# EAGLE design untitled (EAGLE 7.7.0)
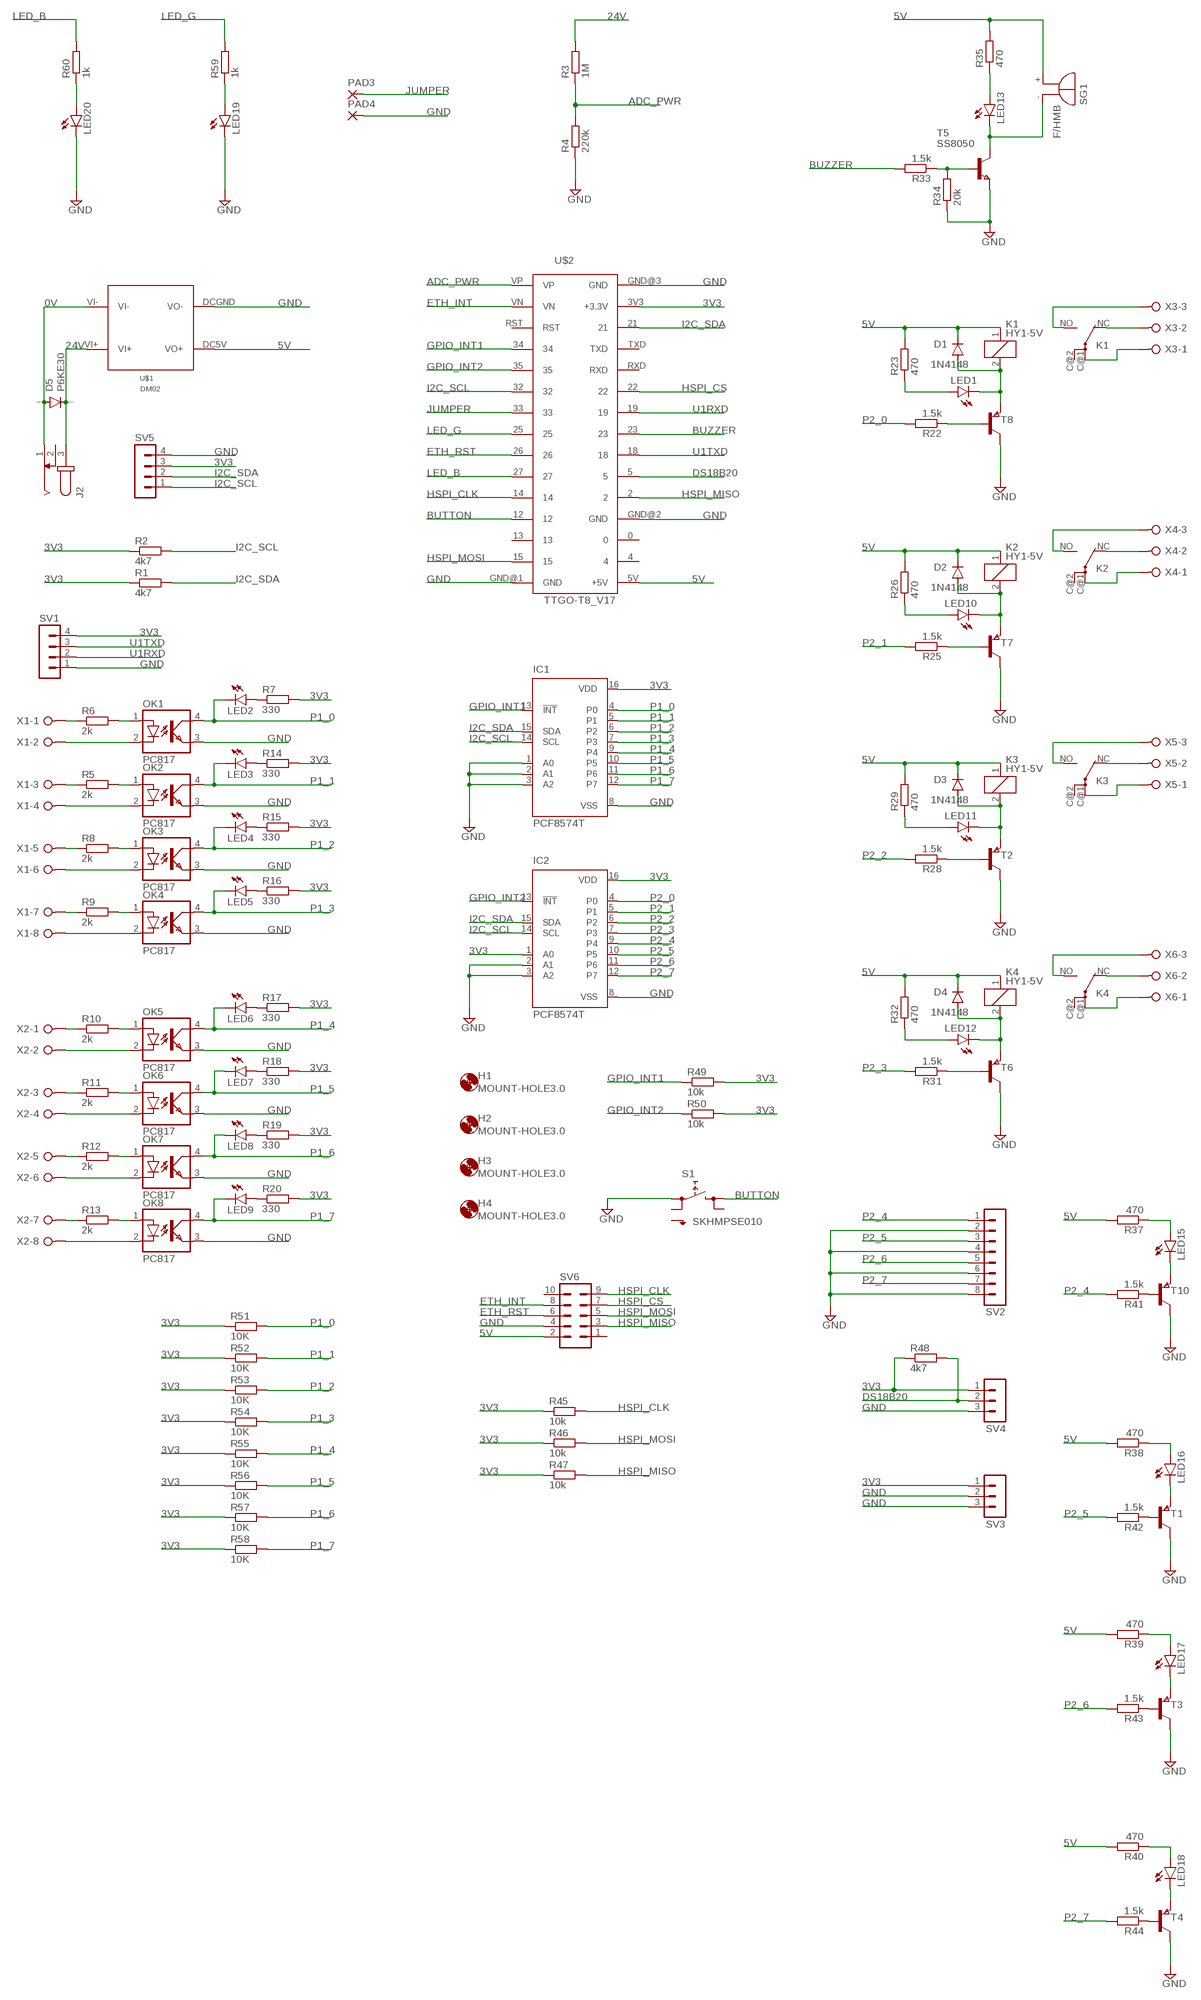
[diagram p0: schematic, sheet 1]

## Parts
D1  1N4148  DIODE-SOD123  [SOD123]
D2  1N4148  DIODE-SOD123  [SOD123]
D3  1N4148  DIODE-SOD123  [SOD123]
D4  1N4148  DIODE-SOD123  [SOD123]
D5  P6KE30  DIODE-D-10  [D-10]
H1  MOUNT-HOLE3.0  [3,0]
H2  MOUNT-HOLE3.0  [3,0]
H3  MOUNT-HOLE3.0  [3,0]
H4  MOUNT-HOLE3.0  [3,0]
IC1  PCF8574T  [SO16W]
IC2  PCF8574T  [SO16W]
J2  JACK-PLUG0  [SPC4077]
K1  HY1-5V  [HY]
K2  HY1-5V  [HY]
K3  HY1-5V  [HY]
K4  HY1-5V  [HY]
LED1  LEDCHIPLED_0805  [CHIPLED_0805]
LED2  LEDCHIPLED_0805  [CHIPLED_0805]
LED3  LEDCHIPLED_0805  [CHIPLED_0805]
LED4  LEDCHIPLED_0805  [CHIPLED_0805]
LED5  LEDCHIPLED_0805  [CHIPLED_0805]
LED6  LEDCHIPLED_0805  [CHIPLED_0805]
LED7  LEDCHIPLED_0805  [CHIPLED_0805]
LED8  LEDCHIPLED_0805  [CHIPLED_0805]
LED9  LEDCHIPLED_0805  [CHIPLED_0805]
LED10  LEDCHIPLED_0805  [CHIPLED_0805]
LED11  LEDCHIPLED_0805  [CHIPLED_0805]
LED12  LEDCHIPLED_0805  [CHIPLED_0805]
LED13  LEDCHIPLED_0805  [CHIPLED_0805]
LED15  LEDCHIPLED_0805  [CHIPLED_0805]
LED16  LEDCHIPLED_0805  [CHIPLED_0805]
LED17  LEDCHIPLED_0805  [CHIPLED_0805]
LED18  LEDCHIPLED_0805  [CHIPLED_0805]
LED19  LEDCHIPLED_0805  [CHIPLED_0805]
LED20  LEDCHIPLED_0805  [CHIPLED_0805]
OK1  PC817  [DIL04]
OK2  PC817  [DIL04]
OK3  PC817  [DIL04]
OK4  PC817  [DIL04]
OK5  PC817  [DIL04]
OK6  PC817  [DIL04]
OK7  PC817  [DIL04]
OK8  PC817  [DIL04]
PAD3  2,15/1,0  [2,15/1,0]
PAD4  2,15/1,0  [2,15/1,0]
R1  4k7  R-EU_R0603  [R0603]
R2  4k7  R-EU_R0603  [R0603]
R3  1M  R-EU_R0603  [R0603]
R4  220k  R-EU_R0603  [R0603]
R5  2k  R-EU_R0603  [R0603]
R6  2k  R-EU_R0603  [R0603]
R7  330  R-EU_R0603  [R0603]
R8  2k  R-EU_R0603  [R0603]
R9  2k  R-EU_R0603  [R0603]
R10  2k  R-EU_R0603  [R0603]
R11  2k  R-EU_R0603  [R0603]
R12  2k  R-EU_R0603  [R0603]
R13  2k  R-EU_R0603  [R0603]
R14  330  R-EU_R0603  [R0603]
R15  330  R-EU_R0603  [R0603]
R16  330  R-EU_R0603  [R0603]
R17  330  R-EU_R0603  [R0603]
R18  330  R-EU_R0603  [R0603]
R19  330  R-EU_R0603  [R0603]
R20  330  R-EU_R0603  [R0603]
R22  1.5k  R-EU_R0603  [R0603]
R23  470  R-EU_R0603  [R0603]
R25  1.5k  R-EU_R0603  [R0603]
R26  470  R-EU_R0603  [R0603]
R28  1.5k  R-EU_R0603  [R0603]
R29  470  R-EU_R0603  [R0603]
R31  1.5k  R-EU_R0603  [R0603]
R32  470  R-EU_R0603  [R0603]
R33  1.5k  R-EU_R0603  [R0603]
R34  20k  R-EU_R0603  [R0603]
R35  470  R-EU_R0603  [R0603]
R37  470  R-EU_R0603  [R0603]
R38  470  R-EU_R0603  [R0603]
R39  470  R-EU_R0603  [R0603]
R40  470  R-EU_R0603  [R0603]
R41  1.5k  R-EU_R0603  [R0603]
R42  1.5k  R-EU_R0603  [R0603]
R43  1.5k  R-EU_R0603  [R0603]
R44  1.5k  R-EU_R0603  [R0603]
R45  10k  R-EU_R0603  [R0603]
R46  10k  R-EU_R0603  [R0603]
R47  10k  R-EU_R0603  [R0603]
R48  4k7  R-EU_R0603  [R0603]
R49  10k  R-EU_R0603  [R0603]
R50  10k  R-EU_R0603  [R0603]
R51  10K  R-EU_R0603  [R0603]
R52  10K  R-EU_R0603  [R0603]
R53  10K  R-EU_R0603  [R0603]
R54  10K  R-EU_R0603  [R0603]
R55  10K  R-EU_R0603  [R0603]
R56  10K  R-EU_R0603  [R0603]
R57  10K  R-EU_R0603  [R0603]
R58  10K  R-EU_R0603  [R0603]
R59  1k  R-EU_R0603  [R0603]
R60  1k  R-EU_R0603  [R0603]
S1  SKHMPSE010  [SKHMPXE010]
SG1  F/HMB  [F/HMB]
SV1  MA04-1  [MA04-1]
SV2  MA08-1  [MA08-1]
SV3  MA03-1  [MA03-1]
SV4  MA03-1  [MA03-1]
SV5  MA04-1  [MA04-1]
SV6  MA05-2  [MA05-2]
T1  PNPSOT23  [SOT-23]
T2  PNPSOT23  [SOT-23]
T3  PNPSOT23  [SOT-23]
T4  PNPSOT23  [SOT-23]
T5  SS8050  NPNSOT23  [SOT-23]
T6  PNPSOT23  [SOT-23]
T7  PNPSOT23  [SOT-23]
T8  PNPSOT23  [SOT-23]
T10  PNPSOT23  [SOT-23]
U$1  DM02  [DM02]
U$2  TTGO-T8_V17  [TTGO-T8_V17]
X1  W237-08P  [W237-8P]
X2  W237-08P  [W237-8P]
X3  W237-03P  [W237-133]
X4  W237-03P  [W237-133]
X5  W237-03P  [W237-133]
X6  W237-03P  [W237-133]

## Nets
0V: D5.A J2.1 U$1.VI-
3V3: IC1.16(VDD) IC2.1(A0) IC2.16(VDD) R1.1 R2.1 R7.2 R14.2 R15.2 R16.2 R17.2 R18.2 R19.2 R20.2 R45.1 R46.1 R47.1 R48.1 R49.2 R50.2 R51.1 R52.1 R53.1 R54.1 R55.1 R56.1 R57.1 R58.1 SV1.4 SV3.1 SV4.1 SV5.3 U$2.3V3(+3.3V)
5V: D1.C D2.C D3.C D4.C K1.1 K2.1 K3.1 K4.1 R23.2 R26.2 R29.2 R32.2 R35.2 R37.2 R38.2 R39.2 R40.2 SG1.+ SV6.2 U$1.DC5V(VO+) U$2.5V(+5V)
24V: D5.C J2.3 R3.2 U$1.VI+
ADC_PWR: R3.1 R4.2 U$2.VP
BUTTON: S1.3(2.1) U$2.12
BUZZER: R33.2 U$2.23
DS18B20: R48.2 SV4.2 U$2.5
ETH_INT: SV6.8 U$2.VN
ETH_RST: SV6.6 U$2.26
GND: IC1.1(A0) IC1.2(A1) IC1.3(A2) IC1.8(VSS) IC2.2(A1) IC2.3(A2) IC2.8(VSS) LED19.C LED20.C OK1.3(EMIT) OK2.3(EMIT) OK3.3(EMIT) OK4.3(EMIT) OK5.3(EMIT) OK6.3(EMIT) OK7.3(EMIT) OK8.3(EMIT) PAD4.1(P) R4.1 R34.1 S1.1(1.1) SV1.1 SV2.2 SV2.4 SV2.6 SV2.8 SV3.2 SV3.3 SV4.3 SV5.4 SV6.4 T1.1(C) T2.1(C) T3.1(C) T4.1(C) T5.2(E) T6.1(C) T7.1(C) T8.1(C) T10.1(C) U$1.DCGND(VO-) U$2.GND@1(GND) U$2.GND@2(GND) U$2.GND@3(GND)
GPIO_INT1: IC1.13(!INT) R49.1 U$2.34
GPIO_INT2: IC2.13(!INT) R50.1 U$2.35
HSPI_CLK: R45.2 SV6.9 U$2.14
HSPI_CS: SV6.7 U$2.22
HSPI_MISO: R47.2 SV6.3 U$2.2
HSPI_MOSI: R46.2 SV6.5 U$2.15
I2C_SCL: IC1.14(SCL) IC2.14(SCL) R2.2 SV5.1 U$2.32
I2C_SDA: IC1.15(SDA) IC2.15(SDA) R1.2 SV5.2 U$2.21
JUMPER: PAD3.1(P) U$2.33
LED_B: R60.2 U$2.27
LED_G: R59.2 U$2.25
N$1: R5.1 X1.3
N$2: R6.1 X1.1
N$3: OK1.1(A) R6.2
N$4: OK1.2(C) X1.2
N$5: OK2.1(A) R5.2
N$6: OK2.2(C) X1.4
N$7: R8.1 X1.5
N$8: OK3.1(A) R8.2
N$9: OK3.2(C) X1.6
N$10: R9.1 X1.7
N$11: OK4.1(A) R9.2
N$12: OK4.2(C) X1.8
N$13: R10.1 X2.1
N$14: OK5.1(A) R10.2
N$15: OK5.2(C) X2.2
N$16: R11.1 X2.3
N$17: OK6.1(A) R11.2
N$18: OK6.2(C) X2.4
N$19: R12.1 X2.5
N$20: OK7.1(A) R12.2
N$21: OK7.2(C) X2.6
N$22: R13.1 X2.7
N$23: OK8.1(A) R13.2
N$24: OK8.2(C) X2.8
N$25: R25.1 T7.3(B)
N$26: LED1.A R23.1
N$27: D2.A K2.2 LED10.C T7.2(E)
N$28: LED2.A R7.1
N$29: LED3.A R14.1
N$30: LED4.A R15.1
N$32: LED15.A R37.1
N$33: LED16.C T1.2(E)
N$34: LED5.A R16.1
N$35: LED19.A R59.1
N$36: R22.1 T8.3(B)
N$37: D1.A K1.2 LED1.C T8.2(E)
N$38: K1.NO(2:S) X3.3
N$39: K1.NC(2:O) X3.2
N$40: R28.1 T2.3(B)
N$41: D3.A K3.2 LED11.C T2.2(E)
N$42: LED10.A R26.1
N$43: LED11.A R29.1
N$44: R31.1 T6.3(B)
N$45: D4.A K4.2 LED12.C T6.2(E)
N$46: LED12.A R32.1
N$47: K1.C@1(2:P) X3.1
N$48: K2.NO(2:S) X4.3
N$49: K2.NC(2:O) X4.2
N$50: K2.C@1(2:P) X4.1
N$51: K3.NO(2:S) X5.3
N$52: K3.NC(2:O) X5.2
N$53: K3.C@1(2:P) X5.1
N$54: K4.NO(2:S) X6.3
N$55: K4.NC(2:O) X6.2
N$56: K4.C@1(2:P) X6.1
N$57: LED15.C T10.2(E)
N$58: LED20.A R60.1
N$59: R33.1 R34.2 T5.3(B)
N$60: R41.1 T10.3(B)
N$61: LED13.A R35.1
N$62: LED13.C SG1.- T5.1(C)
N$63: LED9.A R20.1
N$64: LED16.A R38.1
N$65: LED17.C T3.2(E)
N$66: LED17.A R39.1
N$67: LED18.C T4.2(E)
N$68: LED18.A R40.1
N$69: R42.1 T1.3(B)
N$70: R43.1 T3.3(B)
N$71: R44.1 T4.3(B)
N$74: LED8.A R19.1
N$75: LED7.A R18.1
N$76: LED6.A R17.1
P1_0: IC1.4(P0) LED2.C OK1.4(COL) R51.2
P1_1: IC1.5(P1) LED3.C OK2.4(COL) R52.2
P1_2: IC1.6(P2) LED4.C OK3.4(COL) R53.2
P1_3: IC1.7(P3) LED5.C OK4.4(COL) R54.2
P1_4: IC1.9(P4) LED6.C OK5.4(COL) R55.2
P1_5: IC1.10(P5) LED7.C OK6.4(COL) R56.2
P1_6: IC1.11(P6) LED8.C OK7.4(COL) R57.2
P1_7: IC1.12(P7) LED9.C OK8.4(COL) R58.2
P2_0: IC2.4(P0) R22.2
P2_1: IC2.5(P1) R25.2
P2_2: IC2.6(P2) R28.2
P2_3: IC2.7(P3) R31.2
P2_4: IC2.9(P4) R41.2 SV2.1
P2_5: IC2.10(P5) R42.2 SV2.3
P2_6: IC2.11(P6) R43.2 SV2.5
P2_7: IC2.12(P7) R44.2 SV2.7
U1RXD: SV1.2 U$2.19
U1TXD: SV1.3 U$2.18
Unconnected: J2.2 K1.C@2(2:P) K2.C@2(2:P) K3.C@2(2:P) K4.C@2(2:P) S1.2(1.2) S1.4(2.2) S1.5(SH) SV6.1 SV6.10 U$2.0 U$2.4 U$2.13 U$2.RST U$2.RXD U$2.TXD

## Library data of the parts
D1-D4 = diode:DIODE-: DIODE
D5 = diode@1:DIODE-: DIODE
H1-H4 = holes:MOUNT-HOLE: MOUNTING HOLE with drill center marker
IC1 IC2 = micro-philips:PCF8574: I2C-Bus Remote 8-bit I/O expander http://www.semiconductors.philips.com/acrobat_download/datasheets/PCF8574_4.pdf; MPN: PCF8574T/3,512; OC_FARNELL: 1201255; OC_NEWARK: 70R6870
J2 = con-jack:JACK-PLUG: DC POWER JACK Power Jack, DC, Right Angle, Through Hole, Rated 5A at 16VDC, PC Terminals Distributor: Farnell (www.Farnell.de) Drawing: 84N1161.pdf / 84N1162.pdf Manufacturer: SPC Technology (www.spctechnology.com) Type: SPC4077 / SPC 4078; OC_FARNELL: unknown; OC_NEWARK: unknown
K1-K4 = relay:HY1*: Non-polarized 1 Form C Relay NAiS Source: http://www.mew-europe.com/.. en_ds_61012_0000.pdf; MF: AROMAT/ MATSUSHITA; MPN: HY1-5V; OC_FARNELL: unknown; OC_NEWARK: 10C6692
LED1-LED13 LED15-LED20 = led:LED: LED OSRAM: - CHIPLED LG R971, LG N971, LY N971, LG Q971, LY Q971, LO R971, LY R971 LH N974, LH R974 LS Q976, LO Q976, LY Q976 LO Q996 - Hyper CHIPLED LW Q18S LB Q993, LB Q99A, LB R99A - SideLED LS A670, LO A670, LY A670, LG A670, LP A670 LB A673, LV A673, LT A673, LW A673 LH A674 LY A675 LS A676, LA A676, LO A676, LY A676, LW A676 LS A679, LY A679, LG A679 - Hyper Micro SIDELED® LS Y876, LA Y876, LO Y876, LY Y876 LT Y87S - SmartLED LW L88C, LW L88S LB L89C, LB L89S, LG L890 LS L89K, LO L89K, LY L89K LS L896, LA L896, LO L896, LY L896 - TOPLED LS T670, LO T670, LY T670, LG T670, LP T670 LSG T670, LSP T670, LSY T670, LOP T670, LYG T670 LG T671, LOG T671, LSG T671 LB T673, LV T673, LT T673, LW T673 LH T674 LS T676, LA T676, LO T676, LY T676, LB T676, LH T676, LSB T676, LW T676 LB T67C, LV T67C, LT T67C, LS T67K, LO T67K, LY T67K, LW E67C LS E67B, LA E67B, LO E67B, LY E67B, LB E67C, LV E67C, LT E67C LW T67C LS T679, LY T679, LG T679 LS T770, LO T770, LY T770, LG T770, LP T770 LB T773, LV T773, LT T773, LW T773 LH T774 LS E675, LA E675, LY E675, LS T675 LS T776, LA T776, LO T776, LY T776, LB T776 LHGB T686 LT T68C, LB T68C - Hyper Mini TOPLED® LB M676 - Mini TOPLED Santana® LG M470 LS M47K, LO M47K, LY M47K Source: http://www.osram.convergy.de LUXEON: - LUMILED® LXK2-PW12-R00, LXK2-PW12-S00, LXK2-PW14-U00, LXK2-PW14-V00 LXK2-PM12-R00, LXK2-PM12-S00, LXK2-PM14-U00 LXK2-PE12-Q00, LXK2-PE12-R00, LXK2-PE12-S00, LXK2-PE14-T00, LXK2-PE14-U00 LXK2-PB12-K00, LXK2-PB12-L00, LXK2-PB12-M00, LXK2-PB14-N00, LXK2-PB14-P00, LXK2-PB14-Q00 LXK2-PR12-L00, LXK2-PR12-M00, LXK2-PR14-Q00, LXK2-PR14-R00 LXK2-PD12-Q00, LXK2-PD12-R00, LXK2-PD12-S00 LXK2-PH12-R00, LXK2-PH12-S00 LXK2-PL12-P00, LXK2-PL12-Q00, LXK2-PL12-R00 Source: www.luxeon.com KINGBRIGHT: KA-3528ASYC Source: www.kingbright.com
OK1-OK8 = optocoupler:PC817: SHARP OPTO COUPLER; MPN: PC817X4J000F; OC_FARNELL: 9707727; OC_NEWARK: 97K7059
PAD3 PAD4 = wirepad:2,15/1,0: THROUGH-HOLE PAD
R1-R20 R22 R23 R25 R26 R28 R29 R31-R35 R37-R60 = rcl:R-EU_: RESISTOR, European symbol; SPICEPREFIX: R
S1 = switch:SKHMP*E010: 6.2 X 6.5mm TACT Switch (SMD) Source: http://www3.alps.co.jp/WebObjects/catalog.woa/PDF/E/Switch/Tact/SKHM/SKHM.PDF
SG1 = buzzer:F/HMB: BUZZER Source: Buerklin; OC_FARNELL: unknown; OC_NEWARK: unknown
SV1 SV5 = con-lstb:MA04-1: PIN HEADER; OC_FARNELL: unknown; OC_NEWARK: unknown
SV2 = con-lstb:MA08-1: PIN HEADER; OC_FARNELL: unknown; OC_NEWARK: unknown
SV3 SV4 = con-lstb:MA03-1: PIN HEADER; OC_FARNELL: unknown; OC_NEWARK: unknown
SV6 = con-lstb:MA05-2: PIN HEADER; OC_FARNELL: unknown; OC_NEWARK: unknown
T1-T4 T6-T8 T10 = zetex:PNPSOT23: PNP TRANSISTOR; MPN: DSS20200L-7; OC_FARNELL: unknown; OC_NEWARK: 25R4554
T5 = zetex:NPNSOT23: NPN TRANSISTOR; MPN: DSS20201L-7; OC_FARNELL: 1710688; OC_NEWARK: 25R4555
U$1 = dm02:DM02
U$2 = TTGO-T8:TTGO-T8_V17
X1 X2 = con-wago-508:W237-08P: WAGO SREW CLAMP; OC_FARNELL: unknown; OC_NEWARK: unknown
X3-X6 = con-wago-508:W237-03P: WAGO SREW CLAMP; OC_FARNELL: unknown; OC_NEWARK: unknown

## Board
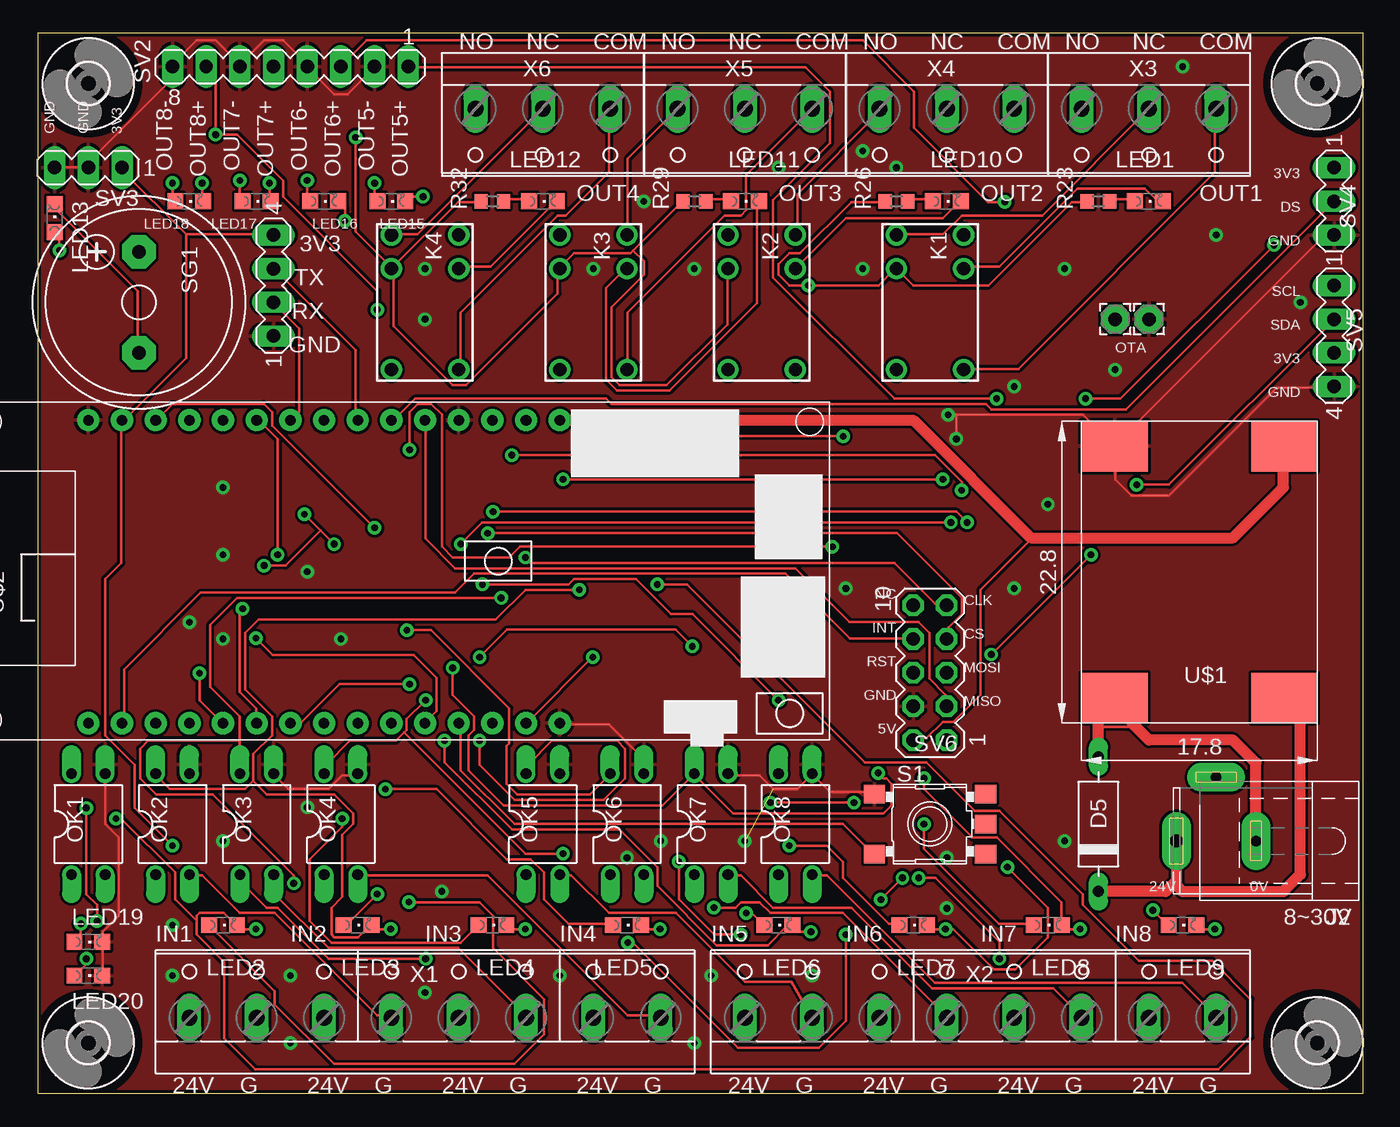
[diagram p1: board, top side]
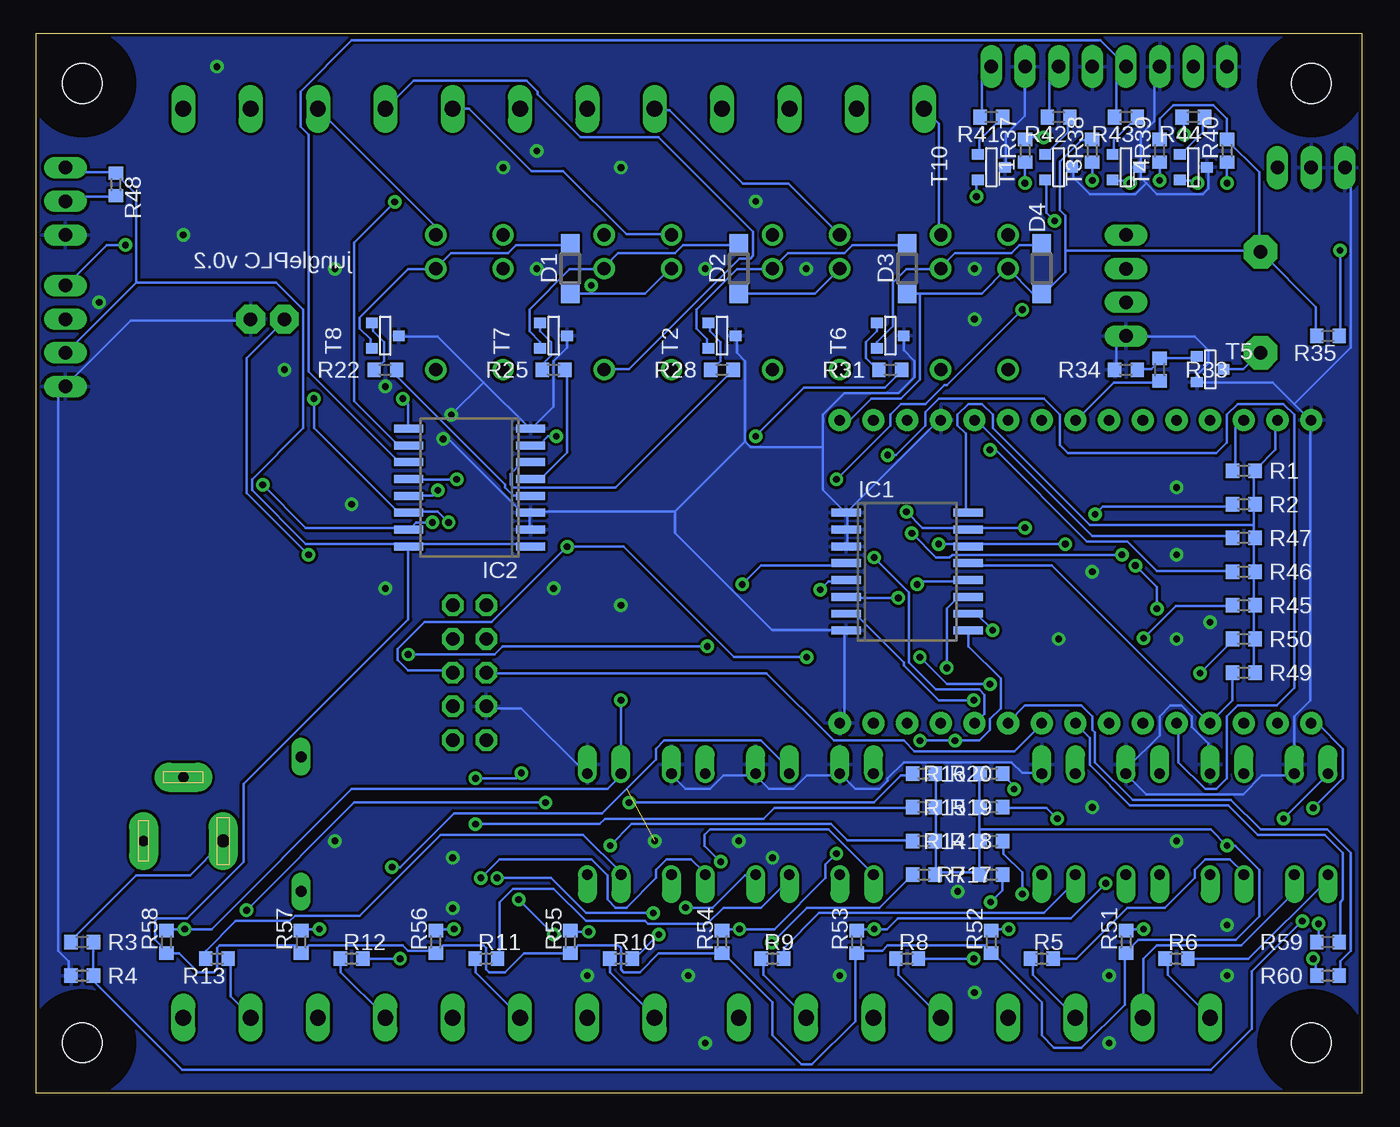
[diagram p2: board, bottom side, seen from below]

Size 100 x 80 mm. Coordinates in mm from the lower left corner, seen from the top.
Outline: 0,0 100,0 100,80 0,80 0,0
Copper layers (1*16): Top 0.035mm / dielectric 1.5mm / Bottom 0.035mm
Design rules "SparkFun": minimum track width 8mil, minimum drill 20mil, track to track 8mil, track to pad 8mil, pad to pad 8mil, via to via 8mil, smd to smd 8mil, copper to edge 10mil, drill to drill 8mil, minimum pad ring 12mil, minimum via ring 10mil, stop-mask expansion 4mil, vias tented up to drill 25mil, thermal gap 10mil

### Footprints (pad centres in the part's own frame; a part is rotated, then mirrored left to right if it is on the bottom)
SOD123 = smd 1.4 x 1.4: A 1.9,0; C -1.9,0
D-10 = drill 0.813 long: A 5.08,0; C -5.08,0
3,0 = hole 3: 0,0
SO16W = smd 0.6 x 2.2: 1 -4.445,-4.6; 2 -3.175,-4.6; 3 -1.905,-4.6; 4 -0.635,-4.6; 5 0.635,-4.6; 6 1.905,-4.6; 7 3.175,-4.6; 8 4.445,-4.6; 9 4.445,4.6; 10 3.175,4.6; 11 1.905,4.6; 12 0.635,4.6; 13 -0.635,4.6; 14 -1.905,4.6; 15 -3.175,4.6; 16 -4.445,4.6
SPC4077 = drill 0.8 pad 2.184 long: 1 -3,0; 2 0,-4.8 | drill 1 pad 2.184 long: 3 3,0
HY = drill 1: 1 -2.54,-2.54; 2 -2.54,2.54; C@1 5.08,2.54; C@2 5.08,-2.54; NC -5.08,-2.54; NO -5.08,2.54
CHIPLED_0805 = smd 1.2 x 1.2: A 0,-1.05; C 0,1.05
DIL04 = drill 0.813 offset: 1 -1.27,-3.81; 2 1.27,-3.81; 3 1.27,3.81; 4 -1.27,3.81
2,15/1,0 = drill 1.016 pad 2.159 octagon: 1 0,0
R0603 = smd 1 x 1.1: 1 -0.85,0; 2 0.85,0
SKHMPXE010 = smd 1.6 x 1.4: 1 -4.2,2.25; 2 4.2,2.25; 3 -4.2,-2.25; 4 4.2,-2.25; 5 4.2,0
F/HMB = drill 1.016 pad 2.54 octagon: + 3.81,0; - -3.81,0
MA04-1 = drill 1.016 long: 1 -3.81,0; 2 -1.27,0; 3 1.27,0; 4 3.81,0
MA08-1 = drill 1.016 long: 1 -8.89,0; 2 -6.35,0; 3 -3.81,0; 4 -1.27,0; 5 1.27,0; 6 3.81,0; 7 6.35,0; 8 8.89,0
MA03-1 = drill 1.016 long: 1 -2.54,0; 2 0,0; 3 2.54,0
MA05-2 = drill 1.016 octagon: 1 -5.08,-1.27; 2 -5.08,1.27; 3 -2.54,-1.27; 4 -2.54,1.27; 5 0,-1.27; 6 0,1.27; 7 2.54,-1.27; 8 2.54,1.27; 9 5.08,-1.27; 10 5.08,1.27
SOT-23 = smd 0.787 x 0.889: 1 0.025,-1.016; 2 -0.94,1.016; 3 0.991,1.016
DM02 = smd 3.8 x 5: DC5V 20.9,-15.3; DCGND 20.9,-2.5; VI+ 1.9,-15.3; VI- 1.9,-2.5
TTGO-T8_V17 = drill 0.8 pad 1.676: 0 24.13,-35.56; 2 24.13,-30.48; 3V3 24.13,-7.62; 4 24.13,-38.1; 5 24.13,-27.94; 5V 24.13,-40.64; 12 1.27,-33.02; 13 1.27,-35.56; 14 1.27,-30.48; 15 1.27,-38.1; 18 24.13,-25.4; 19 24.13,-20.32; 21 24.13,-10.16; 22 24.13,-17.78; 23 24.13,-22.86; 25 1.27,-22.86; 26 1.27,-25.4; 27 1.27,-27.94; 32 1.27,-17.78; 33 1.27,-20.32; 34 1.27,-12.7; 35 1.27,-15.24; GND@1 1.27,-40.64; GND@2 24.13,-33.02; GND@3 24.13,-5.08; RST 1.27,-10.16; RXD 24.13,-15.24; TXD 24.13,-12.7; VN 1.27,-7.62; VP 1.27,-5.08
W237-8P = drill 1.194 long: 1 -17.78,-0.635; 2 -12.7,-0.635; 3 -7.62,-0.635; 4 -2.54,-0.635; 5 2.54,-0.635; 6 7.62,-0.635; 7 12.7,-0.635; 8 17.78,-0.635
W237-133 = drill 1.194 long: 1 -5.08,-0.635; 2 0,-0.635; 3 5.08,-0.635

### Placement (x,y rotation side)
D1  59.69,62.23 90 bottom
D2  46.99,62.23 90 bottom
D3  34.29,62.23 90 bottom
D4  24.13,62.23 90 bottom
D5  80.01,20.32 90 top
H1  96.52,76.2 0 top
H2  3.81,76.2 0 top
H3  96.52,3.81 0 top
H4  3.81,3.81 0 top
IC1  34.29,39.37 270 bottom
IC2  67.31,45.72 90 bottom
J2  88.9,19.05 180 top
K1  67.31,59.69 270 top
K2  54.61,59.69 270 top
K3  41.91,59.69 270 top
K4  29.21,59.69 270 top
LED1  83.82,67.31 270 top
LED2  13.97,12.7 270 top
LED3  24.13,12.7 270 top
LED4  34.29,12.7 270 top
LED5  44.45,12.7 270 top
LED6  55.88,12.7 270 top
LED7  66.04,12.7 270 top
LED8  76.2,12.7 270 top
LED9  86.36,12.7 270 top
LED10  68.58,67.31 270 top
LED11  53.34,67.31 270 top
LED12  38.1,67.31 270 top
LED13  1.27,66.04 0 top
LED15  26.67,67.31 270 top
LED16  21.59,67.31 270 top
LED17  16.51,67.31 270 top
LED18  11.43,67.31 270 top
LED19  3.81,11.43 270 top
LED20  3.81,8.89 270 top
OK1  3.81,20.32 0 top
OK2  10.16,20.32 0 top
OK3  16.51,20.32 0 top
OK4  22.86,20.32 0 top
OK5  38.1,20.32 0 top
OK6  44.45,20.32 0 top
OK7  50.8,20.32 0 top
OK8  57.15,20.32 0 top
PAD3  81.28,58.42 0 top
PAD4  83.82,58.42 0 top
R1  8.89,46.99 180 bottom
R2  8.89,44.45 180 bottom
R3  96.52,11.43 180 bottom
R4  96.52,8.89 0 bottom
R5  24.13,10.16 0 bottom
R6  13.97,10.16 0 bottom
R7  27.94,16.51 180 bottom
R8  34.29,10.16 0 bottom
R9  44.45,10.16 0 bottom
R10  55.88,10.16 0 bottom
R11  66.04,10.16 0 bottom
R12  76.2,10.16 0 bottom
R13  86.36,10.16 180 bottom
R14  27.94,19.05 180 bottom
R15  27.94,21.59 180 bottom
R16  27.94,24.13 180 bottom
R17  33.02,16.51 0 bottom
R18  33.02,19.05 0 bottom
R19  33.02,21.59 0 bottom
R20  33.02,24.13 0 bottom
R22  73.66,54.61 0 bottom
R23  80.01,67.31 180 top
R25  60.96,54.61 0 bottom
R26  64.77,67.31 180 top
R28  48.26,54.61 0 bottom
R29  49.53,67.31 180 top
R31  35.56,54.61 0 bottom
R32  34.29,67.31 180 top
R33  15.24,54.61 270 bottom
R34  17.78,54.61 0 bottom
R35  2.54,57.15 180 bottom
R37  25.4,71.12 90 bottom
R38  20.32,71.12 90 bottom
R39  15.24,71.12 90 bottom
R40  10.16,71.12 90 bottom
R41  27.94,73.66 180 bottom
R42  22.86,73.66 180 bottom
R43  17.78,73.66 180 bottom
R44  12.7,73.66 180 bottom
R45  8.89,36.83 180 bottom
R46  8.89,39.37 180 bottom
R47  8.89,41.91 180 bottom
R48  93.98,68.58 270 bottom
R49  8.89,31.75 0 bottom
R50  8.89,34.29 0 bottom
R51  17.78,11.43 90 bottom
R52  27.94,11.43 90 bottom
R53  38.1,11.43 90 bottom
R54  48.26,11.43 90 bottom
R55  59.69,11.43 90 bottom
R56  69.85,11.43 90 bottom
R57  80.01,11.43 90 bottom
R58  90.17,11.43 90 bottom
R59  2.54,11.43 0 bottom
R60  2.54,8.89 0 bottom
S1  67.31,20.32 0 top
SG1  7.62,59.69 90 top
SV1  17.78,60.96 90 top
SV2  19.05,77.47 180 top
SV3  3.81,69.85 180 top
SV4  97.79,67.31 270 top
SV5  97.79,57.15 270 top
SV6  67.31,31.75 90 top
T1  22.86,69.85 90 bottom
T2  48.26,57.15 90 bottom
T3  17.78,69.85 90 bottom
T4  12.7,69.85 90 bottom
T5  11.43,54.61 90 bottom
T6  35.56,57.15 90 bottom
T7  60.96,57.15 90 bottom
T8  73.66,57.15 90 bottom
T10  27.94,69.85 90 bottom
U$1  78.74,27.94 90 top
U$2  -1.27,26.67 90 top
X1  29.21,6.35 0 top
X2  71.12,6.35 0 top
X3  83.82,73.66 180 top
X4  68.58,73.66 180 top
X5  53.34,73.66 180 top
X6  38.1,73.66 180 top

### Tracks (layer width: path | path; a pad name or v marks a point on that pad's centre or on a via)
0V
  Top 0.203: 80.01,29.21 80.26,29.46 80.87,29.46 81.08,29.67 U$1.VI- | 80.01,27.64 82.3,27.64 82.58,27.91
  Top 0.813: D5.A 80.01,27.64 80.01,29.21 | J2.1 91.9,24.94 90.17,26.67 83.82,26.67 82.58,27.91 82.55,27.94
3V3  (via drill 0.51)
  Top 0.203: 11.18,64.82 17.68,64.82 SV1.4 | 11.18,64.82 6.3,69.7 SV3.1 | 11.18,64.82 11.18,55.47 6.5,50.8 U$2.3V3 6.3,50.8 6.3,40.03 5.08,38.81 5.08,27.03 7.32,24.79 7.32,21.54 v10.16,18.69
  Bottom 0.203: R49.2 8.13,31.9 8.13,34.14 R50.2 8.13,34.34 8.13,36.78 R45.1 8.13,36.98 8.13,39.22 R46.1 8.13,39.42 8.13,41.86 R47.1 8.13,42.06 8.13,42.88 | 8.13,42.88 8.13,44.3 R2.1 8.13,44.5 8.13,46.94 R1.1 7.92,47.14 6.5,48.56 6.5,50.8 U$2.3V3 | 8.13,42.88 20.52,42.88 27.84,50.19 27.84,51.21 28.65,52.02 29.67,52.02 30.48,51.21 30.48,50.39 29.87,49.78 29.87,43.89 IC1.16 | 28.85,16.66 28.85,18.9 R14.2 28.85,19.1 28.85,19.91 | R16.2 28.85,23.98 28.85,21.74 R15.2 28.85,21.54 28.85,19.91 | 32.11,16.66 32.11,18.9 R18.2 32.11,19.1 32.11,21.54 R19.2 32.11,21.74 32.11,23.98 R20.2 | 32.11,16.66 28.85,16.66 | 28.85,16.66 R7.2 | 32.11,16.66 R17.2 | 28.85,19.91 11.38,19.91 v10.16,18.69 9.55,18.69 7.72,16.87 7.72,13.36 9.5,11.58 16.87,11.58 17.68,10.77 R51.1 17.88,10.57 17.88,6.71 21.13,3.45 23.22,3.45 24.13,4.37 24.13,6.86 27.84,10.57 R52.1 28.04,10.77 28.45,11.18 35.76,11.18 36.17,10.77 38,10.77 R53.1 38.2,10.57 38.2,5.44 41.45,2.18 42.27,2.18 44.45,4.37 44.45,6.86 48.16,10.57 R54.1 48.36,10.57 53.03,10.57 54.46,9.14 55.68,9.14 55.88,9.35 55.88,10.97 56.08,11.18 59.13,11.18 59.54,10.77 R55.1 59.74,10.57 63.2,10.57 64.62,9.14 65.84,9.14 66.04,9.35 66.04,10.97 66.24,11.18 69.29,11.18 69.7,10.77 R56.1 69.9,10.77 71.93,10.77 72.34,11.18 79.45,11.18 79.86,10.77 R57.1 80.06,10.77 80.47,11.18 86.16,11.18 86.36,10.97 86.36,9.35 86.56,9.14 87.78,9.14 89.2,10.57 90.02,10.57 R58.1 90.22,10.77 91.03,11.58 91.03,13.01 90.83,13.21 88.59,13.21 84.33,17.48 84.33,23.37 71.93,35.76 71.93,41.25 IC2.16 | SV4.1 97.74,69.7 97.54,69.49 94.08,69.49 R48.1 93.88,69.29 92.46,67.87 92.46,61.16
  Bottom 0.203: 92.46,61.16 97.74,55.88 SV5.3 | IC2.1 62.79,41.45 71.73,41.45 IC2.16 | 92.46,61.16 81.89,61.16 79.86,59.13 79.86,50.19 83.72,46.33 83.72,45.52 79.65,41.45 71.93,41.45 IC2.16
5V  (via drill 0.51)
  Top 0.203: SV6.2 66.04,26.82 67.06,26.82 68.28,28.04 69.09,28.04 71.12,30.07 71.12,38 74.78,41.66 74.93,41.91 | U$1.DC5V 94.08,48.77 94.08,47.35 93.98,46.99 | R26.2 63.8,67.26 61.37,67.26 57.51,63.4 56.69,63.4 55.88,62.59 55.88,61.77 56.69,60.96 v58.12,60.96 63.4,60.96 64.62,62.18 K1.1 66.04,60.96 71.73,60.96 78.03,67.26 79.05,67.26 R23.2 | 44.91,63.6 44.7,63.4 40.44,63.4 39.42,62.38 K3.1 39.22,62.18 39.22,60.35 32.31,53.44 31.29,53.44 26.82,57.91 26.82,62.18 K4.1 | 44.91,63.6 48.56,67.26 R29.2 | v23.98,72.14 23.98,65.02 26.62,62.38 K4.1 | K4.1 31.7,67.26 33.33,67.26 R32.2 | 44.91,63.6 45.72,62.79 45.72,61.77 43.28,59.33 43.28,54.05 43.89,53.44 47.45,53.44 52.02,58.01 52.02,62.18 K2.1
  Top 0.813: U$2.5V 66.04,50.8 74.93,41.91 90.17,41.91 93.98,45.72 93.98,46.99
  Bottom 0.203: 58.12,60.35 54.05,60.35 52.22,62.18 K2.1 | 58.12,60.35 59.54,60.35 D1.C | v58.12,60.96 58.12,60.35 | R39.2 15.24,73.56 14.22,74.57 11.18,74.57 10.16,73.56 R40.2 10.16,71.93 7.72,69.49 7.72,63.6 | R35.2 3.45,57.3 3.45,59.33 SG1.+ 7.72,63.6 | K3.1 41.25,60.35 46.94,60.35 D2.C | 22.35,63.6 22.35,61.98 23.98,60.35 D4.C 24.18,60.35 24.79,60.35 K4.1 26.82,62.18 28.65,60.35 33.33,60.35 | 22.35,63.6 22.35,66.24 22.76,66.65 22.76,70.31 21.13,71.93 20.32,71.93 R38.2 | v23.98,72.14 25.4,72.14 R37.2 | 33.33,60.35 34.14,60.35 D3.C | 22.35,63.6 7.72,63.6 | U$2.5V 38.61,50.8 36.98,52.43 34.75,52.43 33.33,53.85 33.33,60.35
24V
  Top 0.203: U$1.VI+ 94.08,29.67 94.08,29.26 95.1,28.25 95.25,27.94
  Top 0.813: J2.3 85.9,16.05 85.72,15.88 | 85.72,15.88 85.09,15.24 D5.C | 85.72,15.88 86.36,15.24 93.98,15.24 95.25,16.51 95.25,27.94
  Bottom 0.203: R3.2 97.33,11.58 92.46,16.46 88.39,16.46 85.95,18.9 J2.3
ADC_PWR  (via drill 0.51)
  Top 0.203: v4.47,13.01 4.47,14.22 3.66,15.04 v3.66,21.54
  Bottom 0.203: R3.1 95.71,11.38 95.71,8.94 R4.2 95.67,8.45 89,1.78 11.38,1.78 8.28,4.88 8.28,9.2 v4.47,13.01 | v3.66,21.54 1.42,23.77 1.42,26.01 3.25,27.84 3.66,27.84 U$2.VP
BUTTON
  Top 0.203: S1.3 62.99,18.09 60.76,20.32 35.97,20.32 31.9,24.38 31.9,27.84 U$2.12
BUZZER
  Bottom 0.203: R33.2 15.24,53.65 18.69,53.65 21.54,50.8 U$2.23
DS18B20
  Top 0.203: SV4.2 82.09,51.61 71.93,51.61 71.53,52.02 43.28,52.02 42.88,52.43 28.45,52.43 26.82,50.8 U$2.5
  Bottom 0.203: R48.2 94.08,67.67 97.54,67.67 97.74,67.46 SV4.2
ETH_INT
  Top 0.203: SV6.8 66.04,34.34 61.27,34.34 56.39,39.22 32.92,39.22 31.5,37.8 12.29,37.8 6.5,32 6.5,28.04 U$2.VN
ETH_RST
  Bottom 0.203: SV6.6 66.04,31.7 44.91,31.7 39.83,26.62 34.54,26.62 33.73,25.81 26.21,25.81 24.18,27.84 U$2.26
GND  (via drill 0.51)  (1 unrouted)
  Top 0.203: SV4.3 97.74,64.62 96.93,64.62 81.28,48.97 U$1.DCGND | 69.29,51.21 78.84,51.21 81.08,48.97 U$1.DCGND | 69.29,51.21 v68.68,51.21 | U$1.DCGND 81.28,48.77 81.28,46.33 82.5,45.11 85.34,45.11 93.47,53.24 97.74,53.24 SV5.4 | SV3.3 1.42,69.9 3.66,69.9 SV3.2 3.86,69.9 3.86,70.31 10.16,76.61 SV2.8 10.16,77.62 11.99,79.45 13.41,79.45 15.24,77.62 | 15.24,77.62 17.07,79.45 18.49,79.45 20.32,77.62 SV2.4 20.32,77.42 22.35,75.39 23.37,75.39 25.4,77.42 SV2.2 | 15.24,77.62 SV2.6 | LED20.C 4.88,8.94 4.88,11.38 LED19.C 4.88,11.58 4.88,12.19 6.1,13.41 6.1,19.3 5.08,20.32 OK1.3 | OK4.3 23.98,23.98 22.96,23.98 21.95,22.96 18.9,22.96 17.88,23.98 OK3.3 | S1.1 62.99,22.76 59.74,22.76 58.52,23.98 OK8.3 58.32,23.98 57.3,22.96 55.47,22.96 54.46,23.98 52.22,23.98 OK7.3 | OK6.3 45.72,25.2 43.08,27.84 39.42,27.84 U$2.GND@1 | v69.29,49.38 69.29,51.21
  Bottom 0.203: T7.1 59.94,56.29 60.96,55.27 60.96,51.82 62.59,50.19 IC2.8 62.79,50.19 66.24,53.65 | 66.24,53.65 69.7,57.1 72.54,57.1 T8.1 | v68.68,51.21 66.24,53.65 | R4.1 97.54,8.94 97.54,9.96 98.35,10.77 98.35,52.83 97.94,53.24 SV5.4 97.74,53.44 92.86,58.32 83.92,58.32 PAD4.1 | R34.1 18.49,54.66 18.49,56.49 17.88,57.1 SV1.1 17.68,57.1 12.6,57.1 11.58,56.08 11.58,55.07 12.39,54.25 12.39,53.85 T5.2 12.39,53.65 6.71,53.65 5.08,52.02 | 5.08,52.02 3.86,50.8 | SV2.2 25.4,73.76 26.82,72.34 26.82,69.9 T10.1 | 16.26,68.68 16.66,69.09 16.66,69.7 T3.1 16.66,69.9 16.66,72.34 15.65,73.36 15.65,77.01 15.24,77.42 SV2.6 | 16.26,68.68 15.44,67.87 11.99,67.87 11.58,68.28 11.58,69.7 T4.1 | 16.26,68.68 17.07,67.87 20.52,67.87 21.74,69.09 21.74,69.7 T1.1 | 5.08,52.02 0.81,56.29 0.81,69.29 1.22,69.7 SV3.3 | IC2.2 62.79,42.67 62.79,43.69 IC2.3 | IC1.3 38.81,41.45 38.81,42.47 IC1.2 38.81,42.67 38.81,43.69 IC1.1 | T6.1 34.54,56.08 33.73,55.27 33.73,54.05 34.95,52.83 39.01,52.83 40.64,51.21 40.64,48.77 | 40.64,48.77 40.64,45.52 39.01,43.89 IC1.1 | 46.53,49.17 46.53,55.27 47.14,55.88 47.14,57.1 T2.1 | 46.53,49.17 46.13,48.77 40.64,48.77 | 51.82,43.89 62.59,43.89 IC2.3 | 46.53,49.17 51.82,43.89 | U$2.GND@2 31.9,50.8 38.81,43.89 IC1.1 | OK2.3 11.58,24.18 11.58,26.42 12.8,27.64 12.8,28.45 13.61,29.26 14.43,29.26 15.24,28.45 15.24,27.03 17.68,24.59 17.68,24.18 OK3.3 17.68,23.98 16.26,22.55 8.94,22.55 7.52,23.98 5.08,23.98 OK1.3 5.08,28.45 3.86,29.67 3.86,50.8 | U$2.GND@1 39.22,28.04 39.01,28.25 39.01,34.75 IC1.8 39.01,34.95 44.5,34.95 51.82,42.27 51.82,43.89 | 45.72,23.98 44.7,22.96 42.88,22.96 41.86,23.98 39.42,23.98 OK5.3 38.2,22.96 36.37,22.96 35.76,23.57 35.76,23.77 34.54,24.99 26.42,24.99 25.6,24.18 24.18,24.18 OK4.3
  Bottom 0.203: SV6.4 66.04,29.06 63.4,29.06 58.52,24.18 OK8.3 | 45.72,23.98 48.16,23.98 49.17,22.96 51,22.96 52.02,23.98 OK7.3 | 45.72,23.98 OK6.3 | 3.86,50.8 U$2.GND@3 | v69.29,49.38 68.89,49.38 63.4,43.89 62.79,43.89 IC2.3
  other vias: 10.16,8.89 29.21,7.62 49.53,3.81 50.8,8.89 58.42,8.89 19.05,3.81 49.53,62.23 64.77,69.85 62.23,62.23 73.66,38.1 20.32,21.59 30.48,15.24 77.47,19.05 68.58,13.97 13.97,45.72 13.97,40.64 20.32,39.37 55.88,36.83 88.9,64.77 86.36,77.47 77.47,62.23 81.28,54.61 76.2,44.45 73.66,53.34 62.23,71.12 45.72,67.31 41.91,62.23 29.21,58.42 29.21,62.23 13.97,19.05 19.05,8.89 39.37,8.89 11.43,35.56 13.97,34.29 68.58,17.78 60.96,38.1 95.25,59.69 46.99,19.05 53.34,19.05 10.16,12.7 44.45,17.78 22.86,34.29 55.88,69.85
  pour Top: -1.27,81.28 101.6,81.28 101.6,-1.27 0,-1.27 -1.27,0
  pour Bottom: -2.54,82.55 -2.54,-2.54 102.87,-2.54 102.87,82.55
GPIO_INT1
  Bottom 0.203: R49.1 9.75,31.7 9.75,29.67 11.38,28.04 U$2.34 11.58,28.04 23.37,39.83 29.67,39.83 IC1.13
GPIO_INT2  (via drill 0.51)
  Top 0.203: v12.19,31.7 12.19,29.67 13.82,28.04 U$2.35 | v69.7,45.52 69.7,46.13 67.67,48.16 v35.76,48.16
  Bottom 0.203: v12.19,31.7 9.75,34.14 R50.1 | v69.7,45.52 70.1,45.11 71.73,45.11 IC2.13 | v35.76,48.16 35.15,48.16 32.92,50.39 32.92,51.41 31.9,52.43 23.98,52.43 22.76,51.21 22.76,48.92 22.15,48.31 10.97,48.31 10.16,49.12 10.16,51.21 9.35,52.02 5.89,52.02 5.08,51.21 5.08,30.58 6.4,29.26 9.35,29.26 10.16,28.45 10.16,23.77 10.97,22.96 11.79,22.96 13.82,24.99 13.82,27.84 U$2.35
HSPI_CLK  (via drill 0.51)
  Top 0.203: v16.46,34.34 17.73,33.07 28.35,33.07 30.07,31.34 30.07,28.85 29.26,28.04 U$2.14 | v36.78,40.44 37.19,40.03 64.62,40.03 67.67,36.98 68.48,36.98 SV6.9
  Bottom 0.203: v16.46,34.34 14.02,36.78 9.75,36.78 R45.2 | v36.78,40.44 34.14,37.8 34.14,32.51 32.11,30.48 28.85,30.48 28.45,30.07 28.45,28.65 29.06,28.04 U$2.14
HSPI_CS  (via drill 0.51)
  Top 0.203: v33.93,42.27 64.82,42.27 69.7,37.39 69.7,36.17 68.68,35.15 68.68,34.34 SV6.7 | v18.09,40.64 18.09,49.38 16.66,50.8 U$2.22
  Bottom 0.203: v33.93,42.27 32.11,40.44 31.09,40.44 30.89,40.64 v18.09,40.64
HSPI_MISO
  Top 0.203: SV6.3 68.48,29.26 68.48,30.07 67.26,31.29 67.26,34.75 66.45,35.56 61.21,35.56 57.15,39.62 31.5,39.62 29.26,41.86 29.26,50.8 U$2.2
  Bottom 0.203: R47.2 9.75,42.06 20.32,42.06 29.06,50.8 U$2.2
HSPI_MOSI  (via drill 0.51)
  Top 0.203: v28.04,48.56 28.04,51.41 28.65,52.02 29.67,52.02 30.48,51.21 30.48,41.25 31.29,40.44 35.56,40.44 36.37,41.25 v59.94,41.25 | v41.86,32.92 36.98,28.04 U$2.15
  Bottom 0.203: v28.04,48.56 27.64,48.56 20.73,41.66 17.68,41.66 15.44,39.42 9.75,39.42 R46.2 | SV6.5 68.68,31.9 71.93,31.9 72.75,32.72 72.75,33.53 70.71,35.56 65.63,35.56 v59.94,41.25 55.68,41.25 47.35,32.92 v41.86,32.92
I2C_SCL  (via drill 0.51)
  Top 0.203: v22.35,41.45 21.34,42.47 | 21.34,42.47 v20.12,43.69 | v15.44,36.58 15.24,36.37 15.24,30.28 16.46,29.06 16.46,28.04 U$2.32 | v17.07,39.83 18.69,39.83 21.34,42.47 | v79.05,52.43 81.69,52.43 v93.27,64.01 | v31.9,41.45 33.53,43.08 v68.89,43.08
  Bottom 0.203: v20.12,43.69 19.51,44.3 9.75,44.3 R2.2 | v22.35,41.45 29.67,41.45 IC1.14 29.87,41.45 v31.9,41.45 | v15.44,36.58 15.44,38.2 v17.07,39.83 | v79.05,52.43 79.05,50.19 72.75,43.89 71.93,43.89 IC2.14 71.73,43.89 69.7,43.89 v68.89,43.08 | v93.27,64.01 94.69,64.01 97.74,60.96 SV5.1
I2C_SDA  (via drill 0.51)
  Top 0.203: v25.4,42.67 17.68,50.39 17.68,51.41 17.07,52.02 10.16,52.02 8.94,50.8 U$2.21 | v82.91,45.92 85.34,45.92 97.74,58.32 SV5.2 | v34.34,43.89 69.29,43.89 v70.1,43.08
  Bottom 0.203: R1.2 9.55,47.14 9.55,50.19 8.94,50.8 U$2.21 | v25.4,42.67 29.67,42.67 IC1.15 29.87,42.67 33.12,42.67 v34.34,43.89 | v82.91,45.92 79.65,42.67 71.93,42.67 IC2.15 71.73,42.67 71.32,43.08 v70.1,43.08
JUMPER  (via drill 0.51)
  Top 0.203: v28.04,30.89 22.76,30.89 19.91,28.04 19.1,28.04 U$2.33 | v49.38,33.73 48.11,35 35.41,35 v33.33,32.92 | v79.45,40.64 v71.93,33.12
  Bottom 0.203: v28.04,30.89 31.29,30.89 v33.33,32.92 | v49.38,33.73 64.82,33.73 65.43,33.12 v71.93,33.12 | v79.45,40.64 84.12,45.31 84.12,55.47 81.28,58.32 PAD3.1
LED_B
  Bottom 0.203: R60.2 1.63,8.94 1.63,9.96 0.81,10.77 0.81,18.14 2.59,19.91 7.62,19.91 9.86,22.15 17.27,22.15 20.12,24.99 20.12,27.23 20.32,27.43 20.32,28.45 21.13,29.26 25.4,29.26 26.62,28.04 U$2.27
LED_G
  Bottom 0.203: R59.2 1.63,11.58 1.63,14.43 1.42,14.63 1.42,18.14 2.79,19.51 7.82,19.51 10.06,21.74 17.48,21.74 20.52,24.79 20.52,26.82 21.54,27.84 U$2.25
N$1
  Bottom 0.203: R5.1 24.79,10.16 24.79,8.94 21.74,5.89 X1.3
N$2
  Bottom 0.203: R6.1 14.63,10.16 14.63,8.94 11.58,5.89 X1.1
N$3
  Bottom 0.203: R6.2 8.53,10.16 2.64,16.05 2.64,16.46 OK1.1
N$4
  Bottom 0.203: OK1.2 5.08,15.19 9.09,11.18 15.44,11.18 16.46,10.16 16.46,5.89 X1.2
N$5
  Bottom 0.203: R5.2 21.54,10.16 17.68,14.02 14.83,14.02 12.6,16.26 12.6,16.87 11.79,17.68 9.96,17.68 8.94,16.66 OK2.1
N$6
  Top 0.203: OK2.2 11.58,16.46 12.39,16.46 15.24,13.61 17.88,13.61 25.6,5.89 26.62,5.89 X1.4
N$7
  Bottom 0.203: R8.1 34.95,10.16 34.95,8.94 31.9,5.89 X1.5
N$8  (via drill 0.51)
  Top 0.203: v29.26,10.16 21.95,10.16 18.09,14.02 17.27,14.02 15.24,16.05 OK3.1
  Bottom 0.203: v29.26,10.16 R8.2
N$9
  Top 0.203: OK3.2 17.88,16.46 17.88,15.04 21.95,10.97 31.7,10.97 36.78,5.89 X1.6
N$10
  Bottom 0.203: R9.1 45.11,10.16 45.11,8.94 42.06,5.89 X1.7
N$11
  Bottom 0.203: R9.2 43.6,10.96 40.95,13.61 23.98,13.61 21.74,15.85 21.74,16.46 OK4.1
N$12
  Top 0.203: OK4.2 24.18,16.46 33.93,16.46 44.5,5.89 46.94,5.89 X1.8
N$13
  Bottom 0.203: R10.1 56.69,10.16 56.69,9.14 53.44,5.89 X2.1
N$14  (via drill 0.51)
  Top 0.203: v53.03,11.99 51,11.99 48.36,14.63 v48.36,17.48
  Bottom 0.203: v53.03,11.99 54.86,10.16 R10.2 | v48.36,17.48 49.58,18.69 49.58,19.51 49.17,19.91 40.23,19.91 OK5.1
N$15
  Top 0.203: OK5.2 39.42,16.46 40.23,16.46 43.08,13.61 48.16,13.61 53.34,8.43 56.87,8.43 X2.2
N$16
  Bottom 0.203: R11.1 66.85,10.16 66.85,9.14 63.6,5.89 X2.3
N$17
  Bottom 0.203: R11.2 65.02,10.16 65.02,14.43 64.01,15.44 60.96,15.44 58.52,13.01 54.05,13.01 53.85,12.8 49.38,12.8 48.16,14.02 45.31,14.02 43.28,16.05 43.28,16.46 OK6.1
N$18  (via drill 0.51)
  Top 0.203: v51,14.02 52.63,14.02 53.03,14.43 54.46,14.43 55.27,13.61 60.76,13.61 68.48,5.89 X2.4
  Bottom 0.203: v51,14.02 48.97,14.02 46.53,16.46 45.72,16.46 OK6.2
N$19
  Bottom 0.203: R12.1 77.01,10.16 77.01,9.14 73.76,5.89 X2.5
N$20  (via drill 0.51)
  Top 0.203: v72.54,10.16 72.54,11.43 67.72,16.26 v66.45,16.26
  Bottom 0.203: v72.54,10.16 R12.2 | v66.45,16.26 65.02,17.68 58.12,17.68 56.9,16.46 56.9,14.63 56.29,14.02 55.47,14.02 53.24,16.26 53.24,16.87 52.43,17.68 50.6,17.68 49.58,16.66 OK7.1
N$21
  Top 0.203: OK7.2 52.22,16.46 53.03,16.46 55.47,14.02 61.37,14.02 67.46,7.92 76.61,7.92 78.64,5.89 X2.6
N$22
  Bottom 0.203: R13.1 85.34,10.16 85.34,7.32 83.92,5.89 X2.7
N$23
  Bottom 0.203: R13.2 87.17,10.16 87.17,10.77 84.94,13.01 80.87,13.01 80.47,13.41 75.59,13.41 69.49,19.51 58.73,19.51 55.88,16.66 OK8.1
N$24
  Top 0.203: OK8.2 58.52,16.46 59.54,16.46 67.67,8.33 86.36,8.33 88.8,5.89 X2.8
N$25
  Bottom 0.203: T7.3 61.98,57.51 61.16,56.69 61.16,55.68 61.77,55.07 61.77,54.66 R25.1
N$26
  Top 0.203: R23.1 80.87,67.46 82.7,67.46 LED1.A
N$27
  Top 0.203: K2.2 60.96,66.04 68.28,66.04 69.49,67.26 LED10.C
  Bottom 0.203: T7.2 61.98,56.69 62.79,57.51 62.79,59.13 59.74,62.18 57.3,62.18 K2.2 57.1,62.38 56.08,63.4 51.82,63.4 51.21,64.01 47.14,64.01 D2.A
N$28  (via drill 0.51)
  Top 0.203: v27.99,14.43 33.33,14.43 34.34,13.41 34.34,10.97 38.2,7.11 38.2,4.47 35.97,2.23 22.35,2.23 17.88,6.71 17.88,7.72 13.01,12.6 LED2.A
  Bottom 0.203: R7.1 27.09,15.33 v27.99,14.43
N$29  (via drill 0.51)
  Top 0.203: v25.6,15.04 23.16,12.6 LED3.A
  Bottom 0.203: v25.6,15.04 25.6,16.66 27.03,18.09 27.03,18.9 R14.1
N$30  (via drill 0.51)
  Top 0.203: v22.96,20.73 22.96,20.12 20.52,17.68 20.52,13.01 22.15,11.38 31.9,11.38 33.12,12.6 LED4.A
  Bottom 0.203: v22.96,20.73 23.77,21.54 27.03,21.54 R15.1
N$32  (via drill 0.51)
  Top 0.203: v25.4,68.68 25.4,67.67 25.6,67.46 LED15.A
  Bottom 0.203: v25.4,68.68 R37.1
N$33  (via drill 0.51)
  Top 0.203: v23.16,65.84 23.16,66.85 22.76,67.26 LED16.C
  Bottom 0.203: v23.16,65.84 23.77,66.45 23.77,68.89 T1.2
N$34  (via drill 0.51)
  Top 0.203: v26.21,22.96 30.07,22.96 35.36,17.68 37.19,17.68 38.2,16.66 38.2,14.63 40.03,12.8 43.28,12.8 LED5.A
  Bottom 0.203: v26.21,22.96 26.21,23.16 27.03,23.98 R16.1
N$35  (via drill 0.51)
  Top 0.203: v3.25,12.8 3.25,11.99 2.85,11.58 LED19.A
  Bottom 0.203: v3.25,12.8 3.25,11.58 R59.1
N$36
  Bottom 0.203: T8.3 74.57,58.12 74.57,57.51 73.76,56.69 73.76,55.27 74.37,54.66 R22.1
N$37
  Top 0.203: LED1.C 84.73,67.46 84.33,67.46 83.52,68.28 78.44,68.28 72.54,62.38 69.9,62.38 K1.2
  Bottom 0.203: T8.2 74.78,56.29 74.78,56.9 75.59,57.71 75.59,58.52 71.93,62.18 69.9,62.18 K1.2 68.68,63.4 64.41,63.4 63.8,64.01 59.74,64.01 D1.A
N$38
  Bottom 0.203: K1.NO 69.9,64.82 69.9,65.43 78.64,74.17 X3.3
N$39
  Top 0.203: K1.NC 64.82,64.82 68.28,64.82 69.7,66.24 75.79,66.24 83.72,74.17 X3.2
N$40
  Bottom 0.203: T2.3 49.17,58.12 49.17,57.51 48.36,56.69 48.36,55.27 48.97,54.66 R28.1
N$41
  Top 0.203: LED11.C 54.25,67.26 54.25,59.64 47.65,53.03 43.69,53.03 42.88,53.85 42.88,60.76 44.3,62.18 K3.2
  Bottom 0.203: T2.2 49.38,56.29 49.38,56.9 50.19,57.71 50.19,59.13 47.14,62.18 44.5,62.18 K3.2 43.28,63.4 39.01,63.4 38.41,64.01 34.34,64.01 D3.A
N$42
  Top 0.203: R26.1 65.63,67.46 67.46,67.46 LED10.A
N$43
  Top 0.203: R29.1 50.39,67.46 52.22,67.46 LED11.A
N$44
  Bottom 0.203: T6.3 36.58,57.51 37.39,56.69 37.39,55.47 36.58,54.66 R31.1
N$45
  Top 0.203: LED12.C 39.01,67.26 34.14,62.38 31.9,62.38 K4.2
  Bottom 0.203: T6.2 36.58,56.69 35.36,57.91 35.36,61.16 34.34,62.18 31.9,62.18 K4.2 31.7,62.38 30.68,63.4 26.42,63.4 25.81,64.01 24.18,64.01 D4.A
N$46
  Top 0.203: R32.1 35.15,67.46 36.98,67.46 LED12.A
N$47
  Top 0.203: K1.C@1 69.9,54.66 73.97,54.66 88.8,69.49 88.8,74.17 X3.1
N$48
  Top 0.203: K2.NO 57.3,64.82 57.3,67.87 63.6,74.17 X4.3
N$49
  Bottom 0.203: X4.2 67.33,74.3 62.64,69.6 60.25,69.6 55.47,64.82 52.22,64.82 K2.NC
N$50
  Bottom 0.203: K2.C@1 57.1,54.66 55.27,54.66 46.94,62.99 46.13,62.99 45.92,63.2 45.92,65.02 53.03,72.14 58.93,72.14 62.18,75.39 62.18,75.59 62.99,76.4 71.53,76.4 73.56,74.37 X4.1
N$51
  Top 0.203: K3.NO 44.5,64.82 44.5,70.51 48.16,74.17 X5.3
N$52
  Bottom 0.203: K3.NC 43.23,68.63 46.69,68.63 52.22,74.17 53.24,74.17 X5.2
N$53
  Top 0.203: K3.C@1 44.5,54.66 44.5,58.93 51.82,66.24 53.03,66.24 53.44,66.65 53.44,69.29 58.32,74.17 X5.1
N$54
  Bottom 0.203: K4.NO 31.9,64.82 31.9,73.15 32.92,74.17 X6.3
N$55
  Top 0.203: K4.NC 26.82,64.82 28.65,64.82 38,74.17 X6.2
N$56
  Top 0.203: K4.C@1 31.9,54.66 31.9,58.93 39.22,66.24 39.83,66.24 43.08,69.49 43.08,74.17 X6.1
N$57  (via drill 0.51)
  Top 0.203: v29.06,67.67 28.04,67.67 27.84,67.46 LED15.C
  Bottom 0.203: v29.06,67.67 29.06,68.89 T10.2
N$58  (via drill 0.51)
  Top 0.203: v3.66,10.16 3.66,9.75 2.85,8.94 LED20.A
  Bottom 0.203: v3.66,10.16 3.45,9.96 3.45,8.94 R60.1
N$59
  Bottom 0.203: T5.3 12.6,55.47 15.24,55.47 R33.1 15.24,55.27 15.85,54.66 16.87,54.66 R34.2
N$60
  Bottom 0.203: T10.3 28.85,70.92 28.85,71.93 27.23,73.56 R41.1
N$61  (via drill 0.51)
  Top 0.203: v1.63,63.6 1.63,64.62 1.42,64.82 LED13.A
  Bottom 0.203: v1.63,63.6 1.63,57.3 R35.1
N$62
  Top 0.203: LED13.C 1.42,67.06 1.42,66.65 7.52,60.55 7.52,55.88 SG1.-
  Bottom 0.203: T5.1 10.36,54.66 8.94,54.66 7.72,55.88 SG1.-
N$63  (via drill 0.51)
  Top 0.203: v61.57,21.95 v55.27,21.95 | v84.12,13.82 85.14,12.8 LED9.A
  Bottom 0.203: v55.27,21.95 36.78,21.95 34.75,23.98 33.93,23.98 R20.1 | v61.57,21.95 76,21.95 v84.12,13.82
N$64  (via drill 0.51)
  Top 0.203: v20.32,68.89 20.32,67.67 20.52,67.46 LED16.A
  Bottom 0.203: v20.32,68.89 R38.1
N$65  (via drill 0.51)
  Top 0.203: v17.48,68.68 17.48,67.46 LED17.C
  Bottom 0.203: v17.48,68.68 17.68,68.89 18.69,68.89 T3.2
N$66  (via drill 0.51)
  Top 0.203: v15.24,68.89 15.24,67.67 15.44,67.46 LED17.A
  Bottom 0.203: v15.24,68.89 R39.1
N$67  (via drill 0.51)
  Top 0.203: v12.39,68.68 12.39,67.46 LED18.C
  Bottom 0.203: v12.39,68.68 12.6,68.89 13.61,68.89 T4.2
N$68  (via drill 0.51)
  Top 0.203: v10.16,68.68 10.16,67.67 10.36,67.46 LED18.A
  Bottom 0.203: v10.16,68.68 R40.1
N$69
  Bottom 0.203: T1.3 23.77,70.92 22.15,72.54 22.15,73.56 R42.1
N$70
  Bottom 0.203: T3.3 18.69,70.92 18.69,71.93 17.07,73.56 R43.1
N$71
  Bottom 0.203: T4.3 13.61,70.92 11.99,72.54 11.99,73.56 R44.1
N$74  (via drill 0.51)
  Top 0.203: v66.85,20.32 66.85,18.44 72.49,12.8 74.98,12.8 LED8.A
  Bottom 0.203: v66.85,20.32 57.51,20.32 57.1,20.73 45.11,20.73 44.3,21.54 33.93,21.54 R19.1
N$75  (via drill 0.51)
  Top 0.203: v56.69,18.69 59.54,18.69 60.76,17.48 60.76,16.26 64.21,12.8 64.82,12.8 LED7.A
  Bottom 0.203: v56.69,18.69 55.07,20.32 40.03,20.32 38.81,19.1 33.93,19.1 R18.1
N$76  (via drill 0.51)
  Top 0.203: v44.5,11.38 44.91,11.38 52.83,3.45 58.93,3.45 60.96,5.49 v60.96,11.99 | v65.23,16.26 v63.6,14.63 | v53.44,13.61 53.85,13.61 54.66,12.8 LED6.A
  Bottom 0.203: v44.5,11.38 41.86,14.02 36.37,14.02 33.93,16.46 R17.1 | v63.6,14.63 v60.96,11.99 | v65.23,16.26 61.16,16.26 58.52,13.61 v53.44,13.61
P1_0  (via drill 0.51)
  Top 0.203: v16.46,12.39 15.24,12.39 15.04,12.6 LED2.C 14.83,12.8 14.02,13.61 12.19,13.61 11.99,13.41 11.99,13.01 | v46.74,38.41 48.97,38.41 62.38,24.99 67.06,24.99 70.71,21.34 72.54,21.34 78.84,15.04 78.84,14.22 83.06,10.01 88.59,10.01 91.49,7.11 91.49,4.27 89.05,1.83 16.41,1.83 14.07,4.17 14.07,9.91 11.99,11.99 11.99,13.01 | v5.89,20.73 6.3,20.73 10.36,16.66 10.36,14.63 11.99,13.01
  Bottom 0.203: v16.46,12.39 17.68,12.39 R51.2 | v46.74,38.41 45.31,39.83 39.01,39.83 IC1.4 | v5.89,20.73 2.64,23.98 OK1.4
P1_1  (via drill 0.51)
  Top 0.203: v26.62,12.39 25.4,12.39 25.2,12.6 LED3.C 24.99,12.6 24.18,11.79 22.35,11.79 22.15,11.99 22.15,14.02 22.96,14.83 22.96,19.51 23.77,20.32 23.77,21.13 22.35,22.55 17.27,22.55 16.26,23.57 | v40.84,38 36.78,38 34.54,35.76 16.66,35.76 15.65,34.75 15.65,30.48 17.68,28.45 17.68,27.03 16.26,25.6 16.26,23.57 | 16.26,23.57 15.65,22.96 9.96,22.96 8.94,23.98 OK2.4
  Bottom 0.203: v26.62,12.39 27.84,12.39 R52.2 | v40.84,38 40.23,38.61 39.01,38.61 IC1.5
P1_2  (via drill 0.51)
  Top 0.203: v36.78,12.39 35.56,12.39 35.36,12.6 LED4.C | v34.95,37.39 15.04,37.39 13.01,35.36 13.01,30.68 15.24,28.45 15.24,26.62 | OK3.4 15.24,26.62 | v19.3,15.85 19.3,16.46 13.21,22.55 8.94,22.55 7.72,23.77 7.72,26.01 8.33,26.62 15.24,26.62
  Bottom 0.203: R53.2 38,12.39 v36.78,12.39 35.81,12.39 35,13.21 21.95,13.21 v19.3,15.85 | v34.95,37.39 38.81,37.39 IC1.6
P1_3  (via drill 0.51)
  Top 0.203: v46.94,12.39 45.72,12.39 45.52,12.6 LED5.C | v29.26,29.67 27.84,28.25 27.84,27.43 27.64,27.23 | 27.64,27.23 27.03,26.62 23.57,26.62 21.74,24.79 21.74,24.18 OK4.4 | v39.62,18.09 36.78,18.09 27.64,27.23
  Bottom 0.203: R54.2 48.16,12.39 v46.94,12.39 44.3,12.39 40.44,16.26 40.44,17.27 v39.62,18.09 | v29.26,29.67 31.9,29.67 34.54,32.31 34.54,32.51 38.2,36.17 38.81,36.17 IC1.7
P1_4  (via drill 0.51)
  Top 0.203: v58.32,12.19 57.51,12.19 57.1,12.6 LED6.C 56.9,12.6 56.49,12.6 55.07,11.18 51.21,11.18 46.74,15.65 46.74,17.07 43.89,19.91 35.76,19.91 30.68,24.99 v30.68,26.62 | v33.33,26.62 33.33,24.79 35.97,22.15 42.67,22.15 44.3,23.77 44.3,26.01 43.69,26.62 38.81,26.62 36.98,24.79 36.98,24.18 OK5.4
  Bottom 0.203: v58.32,12.19 59.54,12.19 R55.2 | v33.33,26.62 v30.68,26.62 28.85,26.62 28.04,27.43 28.04,28.25 27.23,29.06 27.23,31.29 29.67,33.73 29.67,34.75 IC1.9
P1_5  (via drill 0.51)
  Top 0.203: LED7.C 67.26,12.6 67.46,12.39 v68.48,12.39 69.09,12.39 72.14,9.35 73.76,9.35 76.2,11.79 76.2,14.02 v73.15,17.07 | v27.84,34.95 29.67,34.95 35.56,29.06 35.56,26.42 35.36,26.21 35.36,23.37 36.17,22.55 41.66,22.55 43.08,23.98 OK6.4
  Bottom 0.203: v68.48,12.39 69.7,12.39 R56.2 | v27.84,34.95 29.06,36.17 29.67,36.17 IC1.10 | v73.15,17.07 72.54,17.07 68.48,21.13 57.3,21.13 53.24,25.2 53.24,26.01 52.63,26.62 45.31,26.62 43.28,24.59 43.28,24.18 OK6.4
P1_6  (via drill 0.51)
  Top 0.203: v78.64,12.39 77.62,12.39 77.42,12.6 LED8.C 77.22,12.8 77.22,14.43 72.34,19.3 70.51,19.3 66.85,22.96 v66.85,23.77 | v31.29,32.11 31.29,30.07 32.92,28.45 32.92,27.43 32.51,27.03 32.51,24.38 35.15,21.74 47.14,21.74 OK7.4 49.58,23.98 52.43,21.13 63.8,21.13 64.41,21.74 64.41,23.37 64.01,23.77 63.8,23.77 v63.4,24.18
  Bottom 0.203: v78.64,12.39 79.86,12.39 R57.2 | v31.29,32.11 31.29,36.58 30.48,37.39 29.87,37.39 IC1.11 | v66.85,23.77 63.8,23.77 v63.4,24.18
P1_7  (via drill 0.51)
  Top 0.203: v88.8,12.39 87.78,12.39 87.58,12.6 LED9.C | v33.53,38.41 40.03,38.41 40.44,38.81 45.11,38.81 47.75,36.17 49.38,36.17 v55.88,29.67
  Bottom 0.203: R58.2 90.02,12.39 v88.8,12.39 86.77,12.39 76.2,22.96 56.9,22.96 55.88,23.98 OK8.4 v55.88,29.67 | v33.53,38.41 33.33,38.61 29.87,38.61 IC1.12
P2_0
  Bottom 0.203: R22.2 72.75,54.46 72.75,54.05 64.62,45.92 64.62,45.72 64.01,45.11 62.79,45.11 IC2.4
P2_1
  Bottom 0.203: R25.2 59.94,54.46 59.94,48.36 61.77,46.53 62.59,46.53 IC2.5
P2_2
  Bottom 0.203: R28.2 47.55,54.46 56.29,45.72 64.01,45.72 64.21,45.92 64.21,46.74 63.4,47.55 62.79,47.55 IC2.6
P2_3  (via drill 0.51)
  Top 0.203: v60.76,49.58 v45.72,49.58
  Bottom 0.203: v45.72,49.58 42.06,53.24 35.97,53.24 34.75,54.46 R31.2 | v60.76,49.58 61.37,49.58 61.98,48.97 62.59,48.97 IC2.7
P2_4  (via drill 0.51)
  Top 0.203: v72.34,52.43 64.62,52.43 55.47,61.57 55.47,67.41 59.74,71.68 59.74,75.59 57.91,77.42 28.04,77.42 SV2.1
  Bottom 0.203: R41.2 28.65,73.76 28.65,76.81 28.04,77.42 SV2.1 | v72.34,52.43 71.93,52.02 71.93,50.19 IC2.9
P2_5  (via drill 0.51)
  Top 0.203: v72.95,67.26 71.68,67.26 66.09,72.85 66.09,75.59 62.23,79.45 24.79,79.45 22.96,77.62 SV2.3
  Bottom 0.203: R42.2 23.57,73.76 23.57,76.81 22.96,77.42 SV2.3 | v72.95,67.26 76,64.21 76,52.22 72.75,48.97 71.93,48.97 IC2.10
P2_6
  Bottom 0.203: R43.2 18.49,73.76 18.49,76.81 17.88,77.42 SV2.5 17.88,77.62 19.71,79.45 76.2,79.45 80.06,75.59 80.06,72.95 79.45,72.34 79.45,54.46 72.75,47.75 71.93,47.75 IC2.11
P2_7  (via drill 0.51)
  Top 0.203: SV2.7 12.8,77.42 13.41,76.81 v13.41,72.34 15.04,72.34 18.49,68.89 18.49,67.67 25.6,60.55 v25.6,59.13 | v39.62,46.33 v68.28,46.33
  Bottom 0.203: v13.41,72.34 13.41,73.56 R44.2 | v68.28,46.33 71.73,46.33 IC2.12 | v39.62,46.33 35.56,50.39 35.56,51.21 34.75,52.02 32.92,52.02 31.5,53.44 31.29,53.44 v25.6,59.13
U1RXD
  Top 0.203: SV1.2 17.88,59.54 19.71,57.71 19.71,51.41 19.1,50.8 U$2.19
U1TXD
  Top 0.203: SV1.3 17.88,62.18 23.98,56.08 23.98,50.8 U$2.18

### Text on the board
tPlace: NO | NC | COM | NO | NC | COM | NO | NC | COM | NO | NC | COM | OUT8- | OUT8+ | OUT7- | OUT7+ | OUT6- | OUT6+ | OUT5- | OUT5+ | GND | GND | 3V3 | 3V3 | OUT4 | OUT3 | OUT2 | OUT1 | DS | 3V3 | GND | TX | SCL | RX | SDA | GND | OTA | 3V3 | GND | NC | CLK | INT | CS | RST | MOSI | GND | MISO | 5V | 24V | 0V | 8~30V | IN1 | IN2 | IN3 | IN4 | IN5 | IN6 | IN7 | IN8 | 24V | G | 24V | G | 24V | G | 24V | G | 24V | G | 24V | G | 24V | G | 24V | G
bPlace: junglePLC v0.2